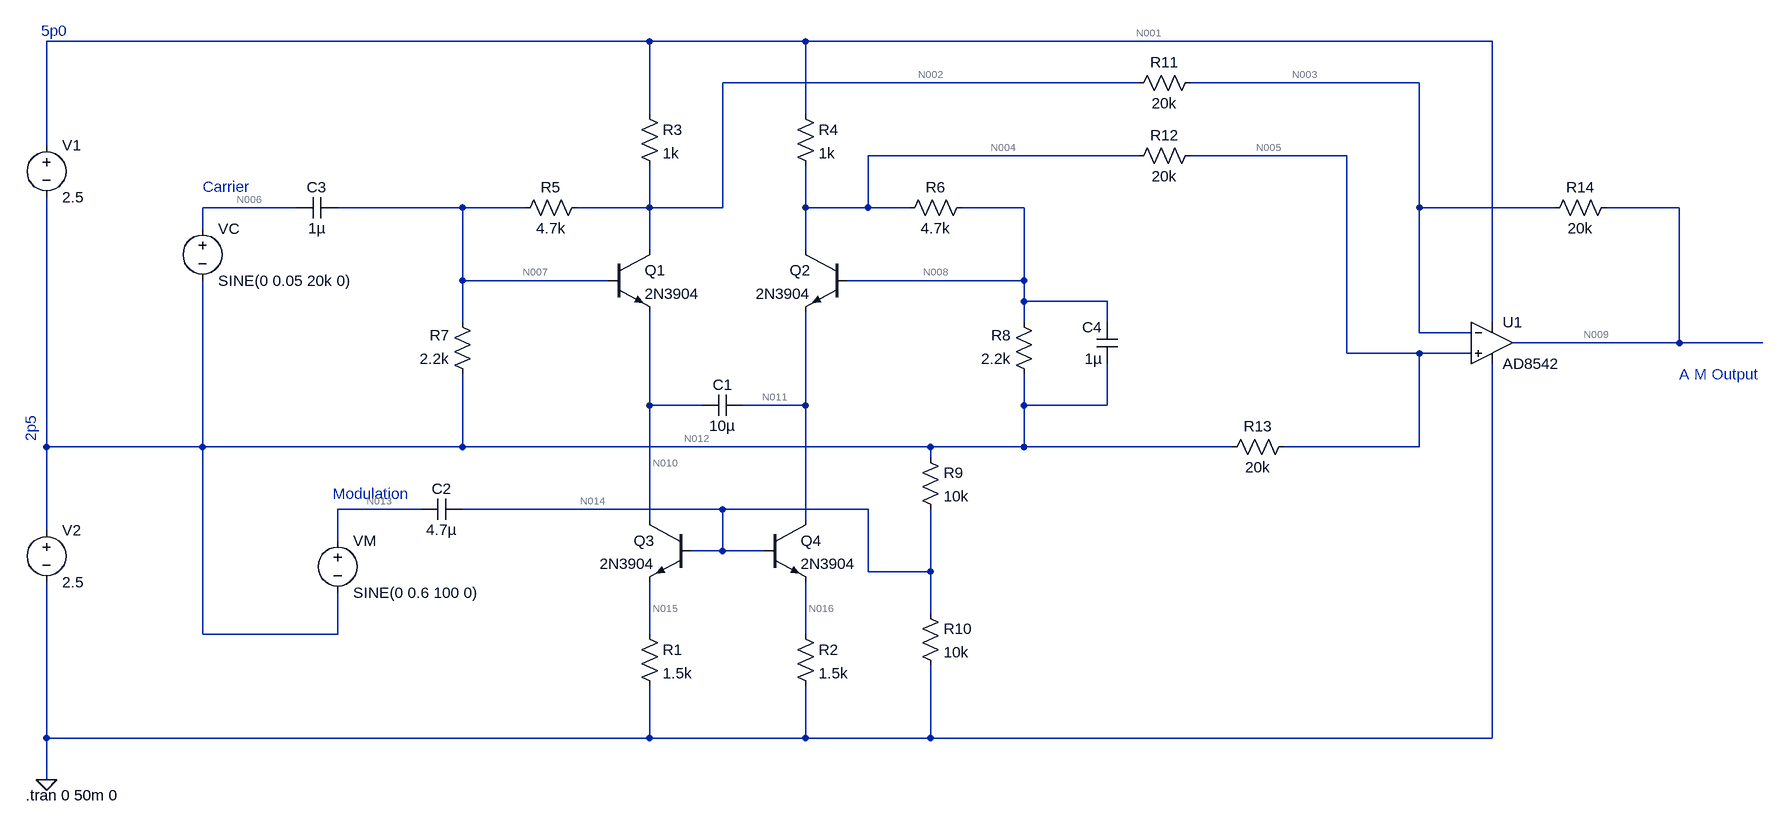
[diagram p0: schematic AmModulator.asc]
AmModulator.asc, the LTspice schematic file:
Version 4.1
SHEET 1 2040 1032
WIRE 320 -144 -608 -144
WIRE 560 -144 320 -144
WIRE 1616 -144 560 -144
WIRE 1072 -80 432 -80
WIRE 1504 -80 1152 -80
WIRE 320 -32 320 -144
WIRE 560 -32 560 -144
WIRE -608 16 -608 -144
WIRE 1072 32 656 32
WIRE 1392 32 1152 32
WIRE -224 112 -368 112
WIRE 32 112 -160 112
WIRE 128 112 32 112
WIRE 320 112 320 48
WIRE 320 112 208 112
WIRE 432 112 432 -80
WIRE 432 112 320 112
WIRE 560 112 560 48
WIRE 656 112 656 32
WIRE 656 112 560 112
WIRE 720 112 656 112
WIRE 896 112 800 112
WIRE 1504 112 1504 -80
WIRE 1712 112 1504 112
WIRE 1904 112 1792 112
WIRE -368 144 -368 112
WIRE 320 176 320 112
WIRE 560 176 560 112
WIRE 32 224 32 112
WIRE 256 224 32 224
WIRE 896 224 896 112
WIRE 896 224 624 224
WIRE 896 256 896 224
WIRE 1024 256 896 256
WIRE 32 288 32 224
WIRE 896 288 896 256
WIRE 1024 288 1024 256
WIRE 1616 288 1616 -144
WIRE 1504 304 1504 112
WIRE 1584 304 1504 304
WIRE 1904 320 1904 112
WIRE 1904 320 1648 320
WIRE 2032 320 1904 320
WIRE 1392 336 1392 32
WIRE 1504 336 1392 336
WIRE 1584 336 1504 336
WIRE 320 416 320 272
WIRE 400 416 320 416
WIRE 560 416 560 272
WIRE 560 416 464 416
WIRE 896 416 896 368
WIRE 1024 416 1024 352
WIRE 1024 416 896 416
WIRE -608 480 -608 96
WIRE -368 480 -368 224
WIRE -368 480 -608 480
WIRE 32 480 32 368
WIRE 32 480 -368 480
WIRE 752 480 32 480
WIRE 896 480 896 416
WIRE 896 480 752 480
WIRE 1216 480 896 480
WIRE 1504 480 1504 336
WIRE 1504 480 1296 480
WIRE 752 496 752 480
WIRE -32 576 -160 576
WIRE 432 576 32 576
WIRE 656 576 432 576
WIRE 320 592 320 416
WIRE 560 592 560 416
WIRE -608 608 -608 480
WIRE -160 624 -160 576
WIRE 432 640 432 576
WIRE 432 640 384 640
WIRE 496 640 432 640
WIRE 656 672 656 576
WIRE 752 672 752 576
WIRE 752 672 656 672
WIRE 752 736 752 672
WIRE -368 768 -368 480
WIRE -160 768 -160 704
WIRE -160 768 -368 768
WIRE 320 768 320 688
WIRE 560 768 560 688
WIRE -608 928 -608 688
WIRE 320 928 320 848
WIRE 320 928 -608 928
WIRE 560 928 560 848
WIRE 560 928 320 928
WIRE 752 928 752 816
WIRE 752 928 560 928
WIRE 1616 928 1616 352
WIRE 1616 928 752 928
WIRE -608 992 -608 928
FLAG -608 992 0
SYMBOL npn 256 176 R0
SYMATTR InstName Q1
SYMATTR Value 2N3904
SYMBOL npn 624 176 M0
SYMATTR InstName Q2
SYMATTR Value 2N3904
SYMBOL cap 464 400 R90
WINDOW 0 0 32 VBottom 2
WINDOW 3 32 32 VTop 2
SYMATTR InstName C1
SYMATTR Value 10µ
SYMBOL npn 384 592 M0
SYMATTR InstName Q3
SYMATTR Value 2N3904
SYMBOL npn 496 592 R0
SYMATTR InstName Q4
SYMATTR Value 2N3904
SYMBOL res 304 752 R0
SYMATTR InstName R1
SYMATTR Value 1.5k
SYMBOL res 544 752 R0
SYMATTR InstName R2
SYMATTR Value 1.5k
SYMBOL res 304 -48 R0
SYMATTR InstName R3
SYMATTR Value 1k
SYMBOL res 544 -48 R0
SYMATTR InstName R4
SYMATTR Value 1k
SYMBOL res 224 96 R90
WINDOW 0 0 56 VBottom 2
WINDOW 3 32 56 VTop 2
SYMATTR InstName R5
SYMATTR Value 4.7k
SYMBOL res 816 96 R90
WINDOW 0 0 56 VBottom 2
WINDOW 3 32 56 VTop 2
SYMATTR InstName R6
SYMATTR Value 4.7k
SYMBOL res 48 384 R180
WINDOW 0 36 76 Left 2
WINDOW 3 36 40 Left 2
SYMATTR InstName R7
SYMATTR Value 2.2k
SYMBOL res 912 384 R180
WINDOW 0 36 76 Left 2
WINDOW 3 36 40 Left 2
SYMATTR InstName R8
SYMATTR Value 2.2k
SYMBOL voltage -608 0 R0
WINDOW 123 0 0 Left 0
WINDOW 39 0 0 Left 0
SYMATTR InstName V1
SYMATTR Value 2.5
SYMBOL voltage -608 592 R0
WINDOW 123 0 0 Left 0
WINDOW 39 0 0 Left 0
SYMATTR InstName V2
SYMATTR Value 2.5
SYMBOL voltage -368 128 R0
WINDOW 123 0 0 Left 0
WINDOW 39 0 0 Left 0
SYMATTR InstName VC
SYMATTR Value SINE(0 0.05 20k 0)
SYMBOL voltage -160 608 R0
WINDOW 123 0 0 Left 0
WINDOW 39 0 0 Left 0
SYMATTR InstName VM
SYMATTR Value SINE(0 0.6 100 0)
SYMBOL cap 32 560 R90
WINDOW 0 0 32 VBottom 2
WINDOW 3 32 32 VTop 2
SYMATTR InstName C2
SYMATTR Value 4.7µ
SYMBOL cap -160 96 R90
WINDOW 0 0 32 VBottom 2
WINDOW 3 32 32 VTop 2
SYMATTR InstName C3
SYMATTR Value 1µ
SYMBOL cap 1040 352 R180
WINDOW 0 24 56 Left 2
WINDOW 3 24 8 Left 2
SYMATTR InstName C4
SYMATTR Value 1µ
SYMBOL res 736 480 R0
SYMATTR InstName R9
SYMATTR Value 10k
SYMBOL res 736 720 R0
SYMATTR InstName R10
SYMATTR Value 10k
SYMBOL res 1168 -96 R90
WINDOW 0 0 56 VBottom 2
WINDOW 3 32 56 VTop 2
SYMATTR InstName R11
SYMATTR Value 20k
SYMBOL res 1168 16 R90
WINDOW 0 0 56 VBottom 2
WINDOW 3 32 56 VTop 2
SYMATTR InstName R12
SYMATTR Value 20k
SYMBOL res 1312 464 R90
WINDOW 0 0 56 VBottom 2
WINDOW 3 32 56 VTop 2
SYMATTR InstName R13
SYMATTR Value 20k
SYMBOL res 1808 96 R90
WINDOW 0 0 56 VBottom 2
WINDOW 3 32 56 VTop 2
SYMATTR InstName R14
SYMATTR Value 20k
SYMBOL OpAmps\\AD8542 1616 256 R0
SYMATTR InstName U1
TEXT -168 552 Left 2 ;Modulation
TEXT -368 80 Left 2 ;Carrier
TEXT 1904 368 Left 2 ;A M Output
TEXT -616 -160 Left 2 ;5p0
TEXT -632 472 VLeft 2 ;2p5
TEXT -640 1016 Left 2 !.tran 0 50m 0

The netlist it stands for:
* AmModulator.asc
Q1 N002 N007 N010 0 2N3904
Q2 N004 N008 N011 0 2N3904
C1 N011 N010 10µ
Q3 N010 N014 N015 0 2N3904
Q4 N011 N014 N016 0 2N3904
R1 N015 0 1.5k
R2 N016 0 1.5k
R3 N001 N002 1k
R4 N001 N004 1k
R5 N002 N007 4.7k
R6 N008 N004 4.7k
R7 N012 N007 2.2k
R8 N012 N008 2.2k
V1 N001 N012 2.5
V2 N012 0 2.5
VC N006 N012 SINE(0 0.05 20k 0)
VM N013 N012 SINE(0 0.6 100 0)
C2 N014 N013 4.7µ
C3 N007 N006 1µ
C4 N012 N008 1µ
R9 N012 N014 10k
R10 N014 0 10k
R11 N003 N002 20k
R12 N005 N004 20k
R13 N005 N012 20k
R14 N009 N003 20k
X§U1 N005 N003 N001 0 N009 AD8542  ; pins In+ In- V+ V- OUT
.model NPN NPN
.model PNP PNP
.lib standard.bjt
* Modulation
* Carrier
* A M Output
* 5p0
* 2p5
.tran 0 50m 0
.lib AD8542.sub
.backanno
.end

* Results of the author's LTspice run, read from the files saved beside the schematic
* Operating Point, zero values left out:
*   V(n001) = 5 V
*   V(n002) = 4.294 V
*   V(n003) = 3.396 V
*   V(n004) = 4.294 V
*   V(n005) = 3.397 V
*   V(n006) = 2.5 V
*   V(n007) = 3.07 V
*   V(n008) = 3.07 V
*   V(n009) = 2.498 V
*   V(n010) = 2.439 V
*   V(n011) = 2.439 V
*   V(n012) = 2.5 V
*   V(n013) = 2.5 V
*   V(n014) = 1.237 V
*   V(n015) = 605.4 mV
*   V(n016) = 605.4 mV
*   I(R1) = 403.6 µA
*   I(R10) = 123.7 µA
*   I(R11) = -44.89 µA
*   I(R12) = -44.85 µA
*   I(R13) = 44.85 µA
*   I(R14) = -44.89 µA
*   I(R2) = 403.6 µA
*   I(R3) = 706.2 µA
*   I(R4) = 706.2 µA
*   I(R5) = 260.4 µA
*   I(R6) = -260.4 µA
*   I(R7) = -259.1 µA
*   I(R8) = -259.1 µA
*   I(R9) = 126.3 µA
*   I(V1) = -1.46 mA
*   I(V2) = -1.023 mA
*   Ib(Q1) = 1.322 µA
*   Ib(Q2) = 1.322 µA
*   Ib(Q3) = 1.326 µA
*   Ib(Q4) = 1.326 µA
*   Ic(Q1) = 400.9 µA
*   Ic(Q2) = 400.9 µA
*   Ic(Q3) = 402.3 µA
*   Ic(Q4) = 402.3 µA
*   Ie(Q1) = -402.3 µA
*   Ie(Q2) = -402.3 µA
*   Ie(Q3) = -403.6 µA
*   Ie(Q4) = -403.6 µA
*   Ix(u1:1) = 4.441 pA
*   Ix(u1:2) = 4.885 pA
*   Ix(u1:3) = 47.47 µA
*   Ix(u1:4) = -92.36 µA
*   Ix(u1:5) = 44.89 µA